# Altium schematic sheet M3_Discrete_Interface.SchDoc
size A
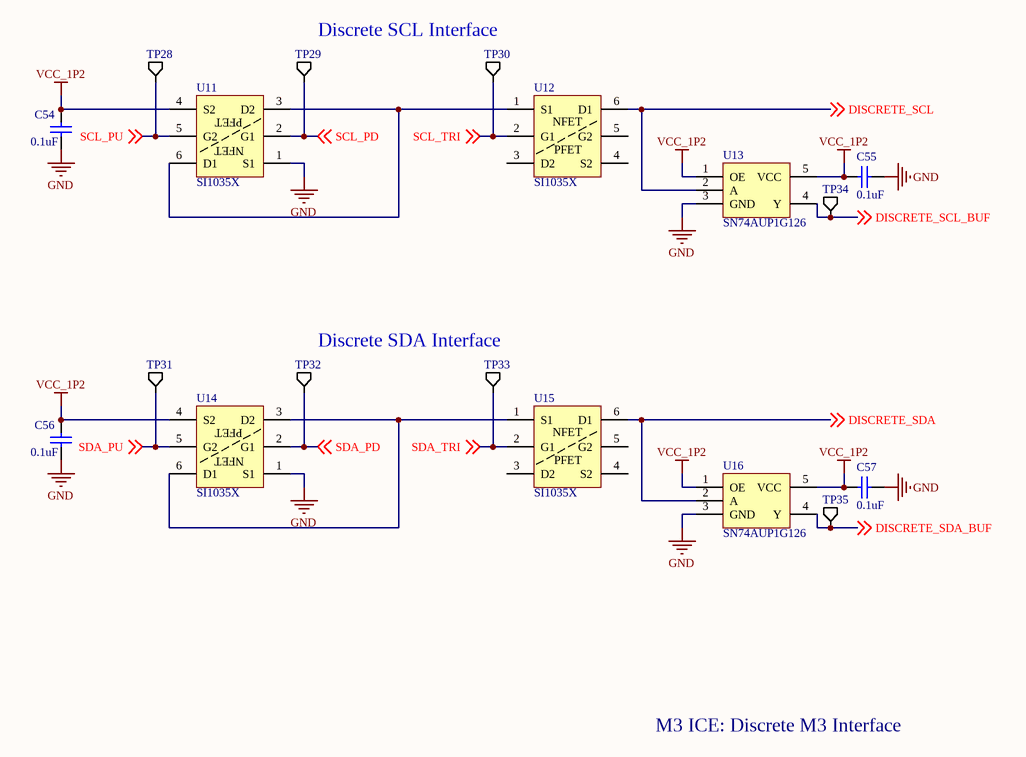
[diagram p0: M3_Discrete_Interface.SchDoc]

## Parts
C54  value 0.1uF  [1608[0603]]  (hidden comment: Cap Semi)
C55  value 0.1uF  [1608[0603]]  (hidden comment: Cap Semi)
C56  value 0.1uF  [1608[0603]]  (hidden comment: Cap Semi)
C57  value 0.1uF  [1608[0603]]  (hidden comment: Cap Semi)
TP28  TP  [TP]  (value not drawn)
TP29  TP  [TP]  (value not drawn)
TP30  TP  [TP]  (value not drawn)
TP31  TP  [TP]  (value not drawn)
TP32  TP  [TP]  (value not drawn)
TP33  TP  [TP]  (value not drawn)
TP34  TP  [TP]  (value not drawn)
TP35  TP  [TP]  (value not drawn)
U11  SI1035X  [SC-89-6]
U12  SI1035X  [SC-89-6]
U13  SN74AUP1G126  [SOT-753]
U14  SI1035X  [SC-89-6]
U15  SI1035X  [SC-89-6]
U16  SN74AUP1G126  [SOT-753]

## Nets
GND: C54.1 C55.1 C56.1 C57.1 U11.1(S1) U13.3(GND) U14.1(S1) U16.3(GND)
VCC_1P2: C54.2 C55.2 C56.2 C57.2 U11.4(S2) U13.1(OE) U13.5(VCC) U14.4(S2) U16.1(OE) U16.5(VCC)
DISCRETE_SCL: U12.6(D1) U13.2(A) ; off-sheet DISCRETE_SCL
DISCRETE_SCL_BUF: TP34.1(A) U13.4(Y) ; off-sheet DISCRETE_SCL_BUF
DISCRETE_SDA: U15.6(D1) U16.2(A) ; off-sheet DISCRETE_SDA
DISCRETE_SDA_BUF: TP35.1(A) U16.4(Y) ; off-sheet DISCRETE_SDA_BUF
SCL_PD: TP29.1(A) U11.2(G1) ; off-sheet SCL_PD
SCL_PU: TP28.1(A) U11.5(G2) ; off-sheet SCL_PU
SCL_TRI: TP30.1(A) U12.2(G1) ; off-sheet SCL_TRI
SDA_PD: TP32.1(A) U14.2(G1) ; off-sheet SDA_PD
SDA_PU: TP31.1(A) U14.5(G2) ; off-sheet SDA_PU
SDA_TRI: TP33.1(A) U15.2(G1) ; off-sheet SDA_TRI
NetU11_3: U11.3(D2) U11.6(D1) U12.1(S1)
NetU14_3: U14.3(D2) U14.6(D1) U15.1(S1)

Not connected (* = marked no-connect by the designer): U12 3(D2) 4(S2) 5(G2); U15 3(D2) 4(S2) 5(G2)

## Notes on the sheet
- Discrete SCL Interface
- Discrete SDA Interface
- M3 ICE: Discrete M3 Interface
- (in symbol SI1035X) PFET; NFET

## Library data of the parts
C54-C57 = Cap Semi: Capacitor (Semiconductor SIM Model); DistPartNo: 445-1317-1-ND; ManPartNo: C1608X7R1C104K; Published: 8-Jun-2000; LatestRevisionDate: 29-May-2009; LatestRevisionNote: IPC-7351 Footprint Added.; PackageReference: C1206; Publisher: Altium Limited; PackageDescription: Chip Capacitor
U11 U12 U14 U15 = SI1035X: Complementary N- and P-Channel 20 V (D-S) MOSFET; DistPartNo: SI1035X-T1-GE3CT-ND; ManPartNo: SI1035X-T1-GE3
U13 U16 = SN74AUP1G126: LOW-POWER SINGLE BUS BUFFER GATE WITH 3-STATE OUTPUT; DistPartNo: 296-18005-1-ND; ManPartNo: SN74AUP1G126DBVR